# EAGLE schematic board (EAGLE 9.5.2)
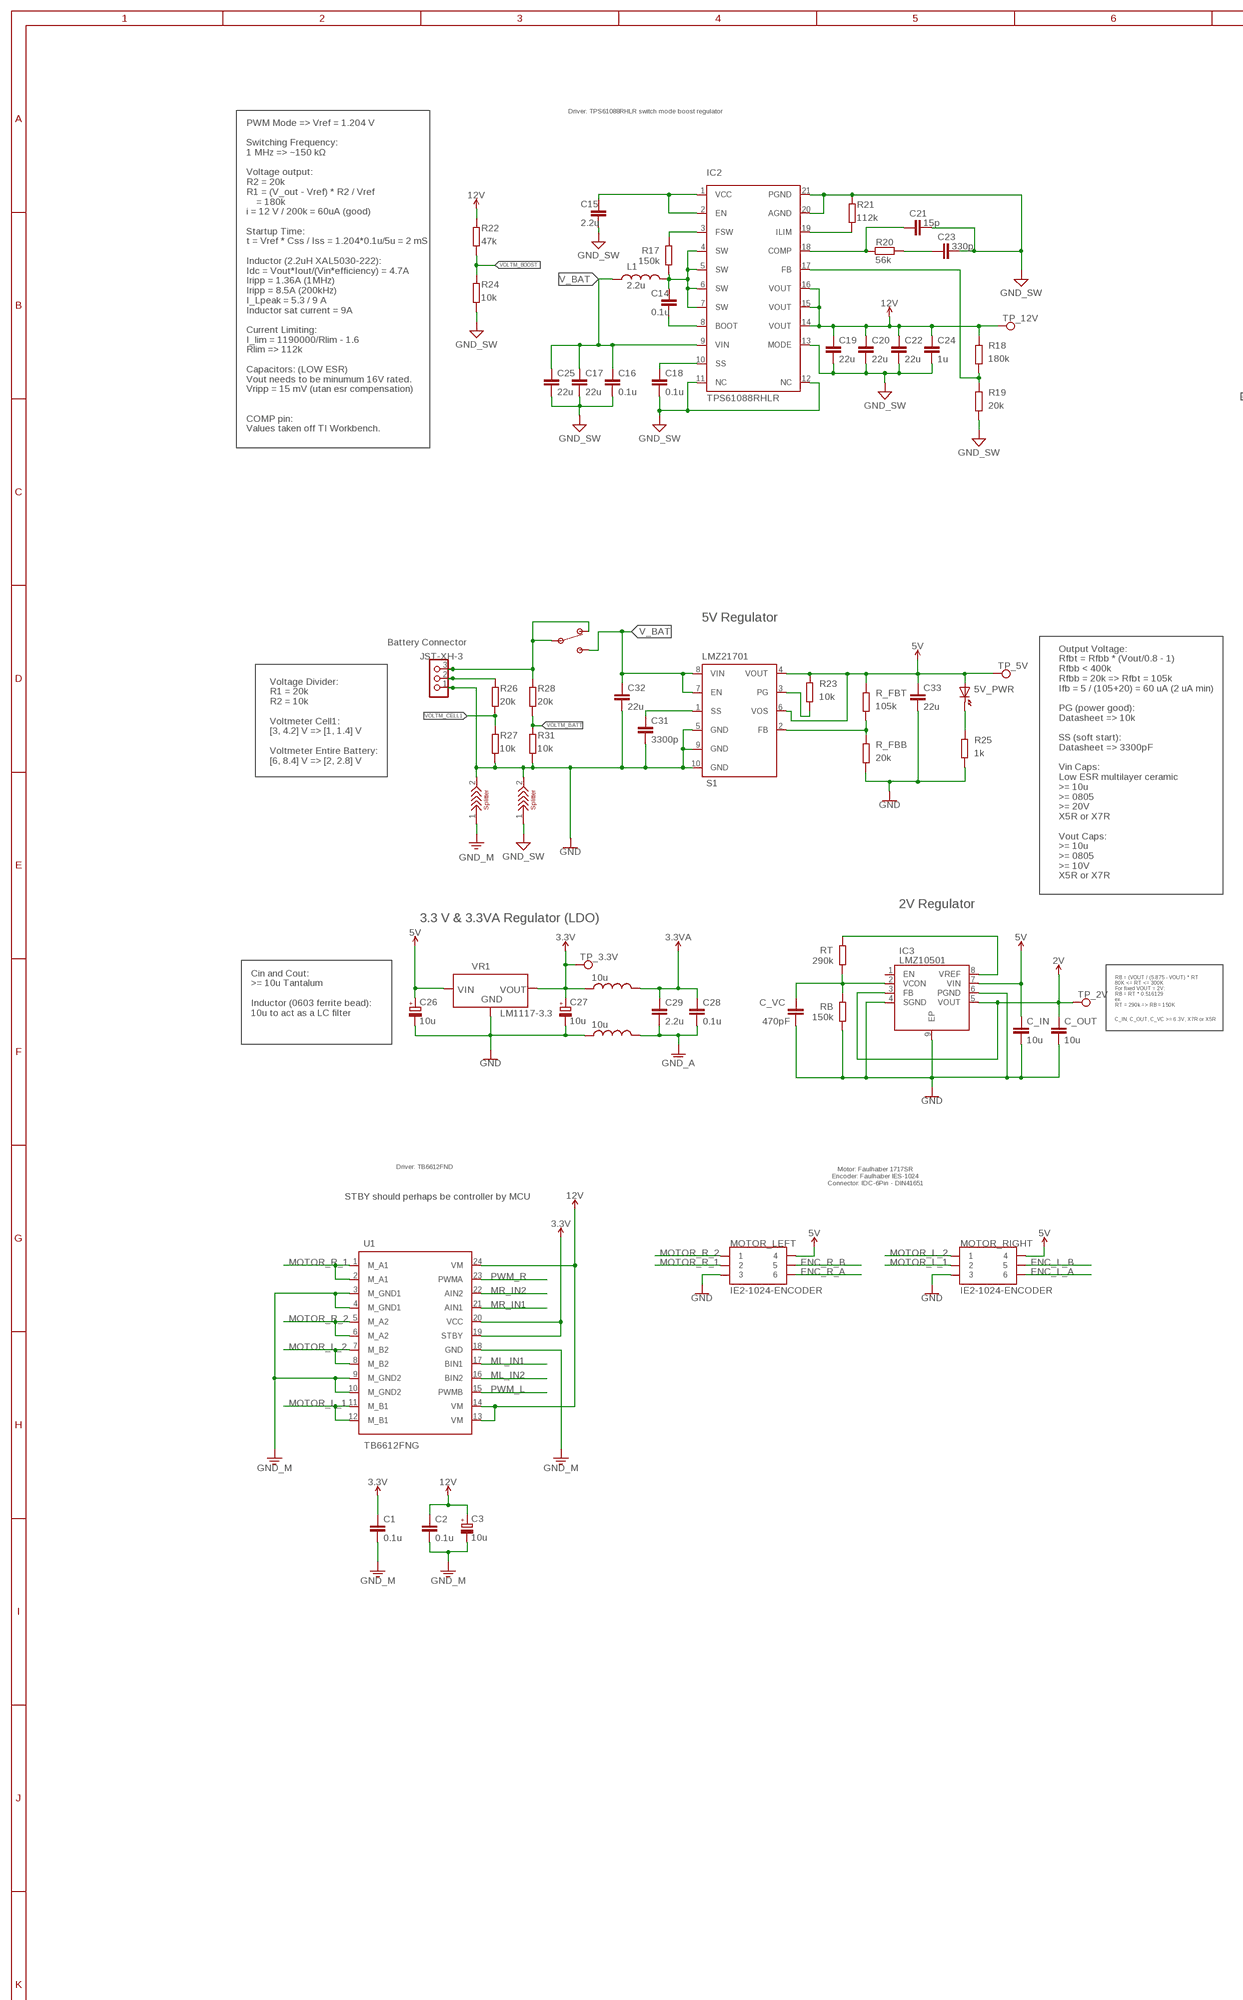
[diagram p0: schematic, sheet 1, part 1 of 3]
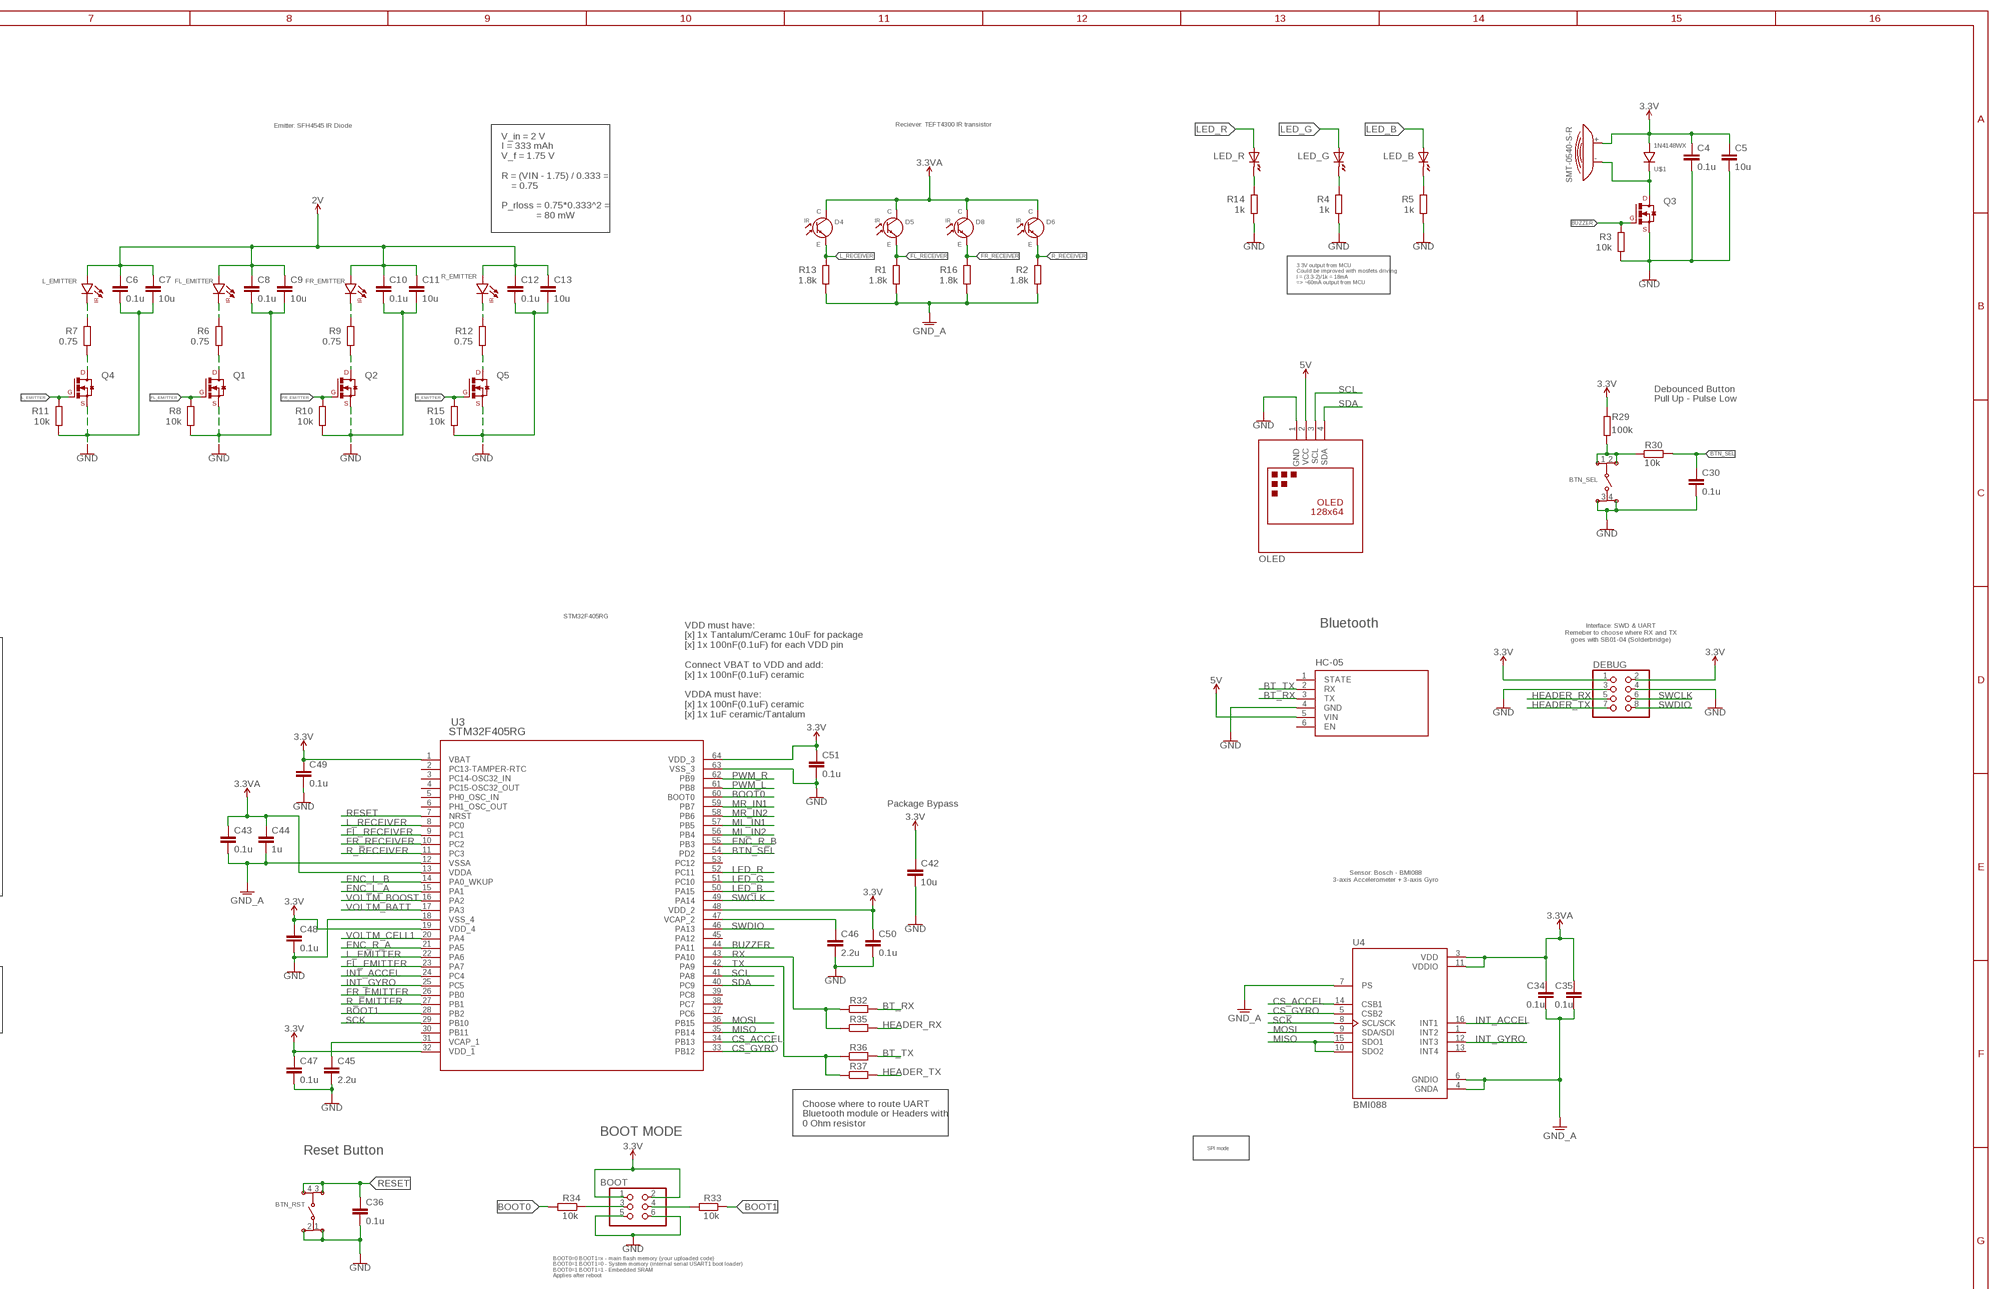
[diagram p1: schematic, sheet 1, part 2 of 3]
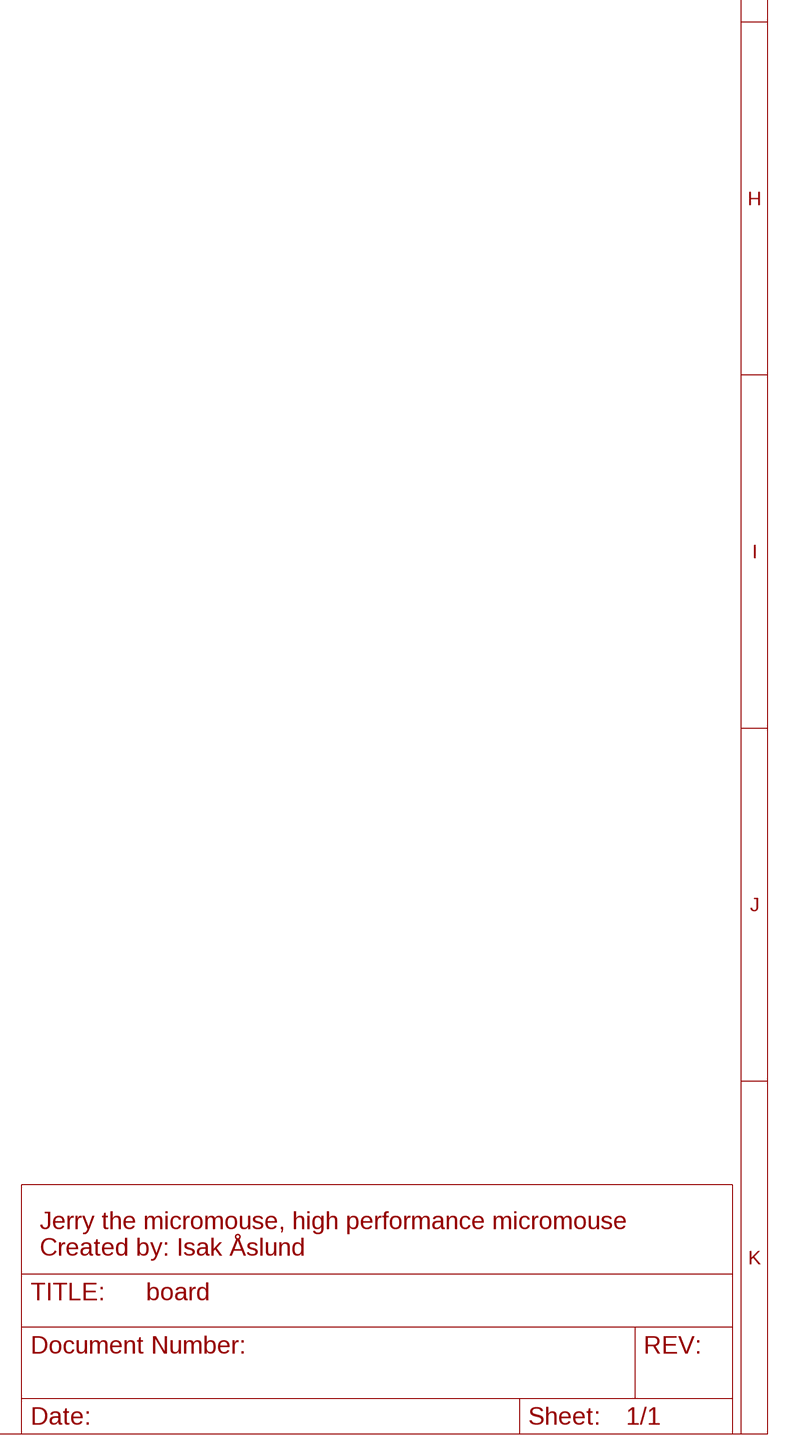
[diagram p2: schematic, sheet 1, part 3 of 3]

## Parts
5V_PWR  CHIP-LED0603  [CHIP-LED0603]
BOOT  PINHD-2X3  [2X03]
BTN_RST  KMR621NGLFS  [KMR621NGLFS]
BTN_SEL  KMR621NGLFS  [KMR621NGLFS]
C1  0.1u  C0603  [C0603]
C2  0.1u  C0603  [C0603]
C3  10u  KEMET_C  [EIA_6032-28]
C4  0.1u  C0603  [C0603]
C5  10u  C0603  [C0603]
C6  0.1u  C0603  [C0603]
C7  10u  C0603  [C0603]
C8  0.1u  C0603  [C0603]
C9  10u  C0603  [C0603]
C10  0.1u  C0603  [C0603]
C11  10u  C0603  [C0603]
C12  0.1u  C0603  [C0603]
C13  10u  C0603  [C0603]
C14  0.1u  C0603  [C0603]
C15  2.2u  C0603  [C0603]
C16  0.1u  C0805  [C0805]
C17  22u  C0805  [C0805]
C18  0.1u  C0603  [C0603]
C19  22u  C0805  [C0805]
C20  22u  C0805  [C0805]
C21  15p  C0603  [C0603]
C22  22u  C0805  [C0805]
C23  330p  C0603  [C0603]
C24  1u  C0805  [C0805]
C25  22u  C0805  [C0805]
C26  10u  SMC_A  [SMC_A]
C27  10u  SMC_A  [SMC_A]
C28  0.1u  C0603  [C0603]
C29  2.2u  C0603  [C0603]
C30  0.1u  C0603  [C0603]
C31  3300p  C0603  [C0603]
C32  22u  C0805  [C0805]
C33  22u  C0805  [C0805]
C34  0.1u  C0603  [C0603]
C35  0.1u  C0603  [C0603]
C36  0.1u  C0603  [C0603]
C42  10u  C0603  [C0603]
C43  0.1u  C0603  [C0603]
C44  1u  C0603  [C0603]
C45  2.2u  C0603  [C0603]
C46  2.2u  C0603  [C0603]
C47  0.1u  C0603  [C0603]
C48  0.1u  C0603  [C0603]
C49  0.1u  C0603  [C0603]
C50  0.1u  C0603  [C0603]
C51  0.1u  C0603  [C0603]
C_IN  10u  C0805  [C0805]
C_OUT  10u  C0805  [C0805]
C_VC  470pF  C0603  [C0603]
D4  TEFT4300  [3MM_PHOTOTRANSISTOR]
D5  TEFT4300  [3MM_PHOTOTRANSISTOR]
D6  TEFT4300  [3MM_PHOTOTRANSISTOR]
D8  TEFT4300  [3MM_PHOTOTRANSISTOR]
DEBUG  PINHD-2X4  [2X04]
FL_EMITTER  SFH_4545  [SFH_4545]
FP1  10u  WE-CBF_0805  [R0805]
FP2  10u  WE-CBF_0805  [R0805]
FR_EMITTER  SFH_4545  [SFH_4545]
HC-05  WIRELESS-BLUETOOTH-HC-05  [WIRELESS-BLUETOOTH-HC-05]
IC2  TPS61088RHLR  [RHL(R-PVQFN-N20)_1]
IC3  LMZ10501  [SON65P260X300X150-9N]
L1  2.2u  XAL5030-222MEC  [XAL5030]
L_EMITTER  SFH_4545  [SFH_4545]
LED_B  CHIP-LED0603  [CHIP-LED0603]
LED_G  CHIP-LED0603  [CHIP-LED0603]
LED_R  CHIP-LED0603  [CHIP-LED0603]
MOTOR_LEFT  IE2-1024-ENCODER  [IE2-1024-ENCODER]
MOTOR_RIGHT  IE2-1024-ENCODER  [IE2-1024-ENCODER]
OLED  DISPLAY-OLED-128X64-I2C  [DISPLAY-OLED-128X64-I2C]
Q1  IRFML8244TRPBF  [SOT95P235X110-3]
Q2  IRFML8244TRPBF  [SOT95P235X110-3]
Q3  IRFML8244TRPBF  [SOT95P235X110-3]
Q4  IRFML8244TRPBF  [SOT95P235X110-3]
Q5  IRFML8244TRPBF  [SOT95P235X110-3]
R1  1.8k  R0603  [R0603]
R2  1.8k  R0603  [R0603]
R3  10k  R0603  [R0603]
R4  1k  R0603  [R0603]
R5  1k  R0603  [R0603]
R6  0.75  R0603  [R0603]
R7  0.75  R0603  [R0603]
R8  10k  R0603  [R0603]
R9  0.75  R0603  [R0603]
R10  10k  R0603  [R0603]
R11  10k  R0603  [R0603]
R12  0.75  R0603  [R0603]
R13  1.8k  R0603  [R0603]
R14  1k  R0603  [R0603]
R15  10k  R0603  [R0603]
R16  1.8k  R0603  [R0603]
R17  150k  R0603  [R0603]
R18  180k  R0603  [R0603]
R19  20k  R0603  [R0603]
R20  56k  R0603  [R0603]
R21  112k  R0603  [R0603]
R22  47k  R0603  [R0603]
R23  10k  R0603  [R0603]
R24  10k  R0603  [R0603]
R25  1k  R0603  [R0603]
R26  20k  R0603  [R0603]
R27  10k  R0603  [R0603]
R28  20k  R0603  [R0603]
R29  100k  R0603  [R0603]
R30  10k  R0603  [R0603]
R31  10k  R0603  [R0603]
R32  0  R0603  [R0603]
R33  10k  R0603  [R0603]
R34  10k  R0603  [R0603]
R35  0  R0603  [R0603]
R36  0  R0603  [R0603]
R37  0  R0603  [R0603]
R_EMITTER  SFH_4545  [SFH_4545]
R_FBB  20k  R0603  [R0603]
R_FBT  105k  R0603  [R0603]
RB  150k  R0603  [R0603]
RT  290k  R0603  [R0603]
S1  LMZ21701  [LMZ21701]
SW  SPDT-500SSP1S1M6QEA  [500SSP1S1M6QEA]
TP_2V  TEST-POINT3X5  [PAD.03X.05]
TP_3.3V  TEST-POINT3X5  [PAD.03X.05]
TP_5V  TEST-POINT3X5  [PAD.03X.05]
TP_12V  TEST-POINT3X5  [PAD.03X.05]
U1  TB6612FNG  [SOP65P760X160-24]
U3  STM32F405RG  [LQFP-64]
U4  BMI088  [PQFN50P450X300X100-16N]
U$1  1N4148WX  DIODE_1N4148WX  [1N4148WX_SOD-323-2]
U$4  SMT-0540-S-R  [SMT-0540-S-R]
U$6  SPLITTER  [SPLITTER]
U$7  SPLITTER  [SPLITTER]
U$10  JST-XH-3  [JST-XH-03]
VR1  LM1117-3.3  [SOT230P700X180-4]

## Nets
2V: C6.1 C7.1 C8.1 C9.1 C10.1 C11.1 C12.1 C13.1 C_OUT.1 FL_EMITTER.+(+_ANODE) FR_EMITTER.+(+_ANODE) IC3.3(FB) IC3.5(VOUT) L_EMITTER.+(+_ANODE) R_EMITTER.+(+_ANODE) TP_2V.P$1
3.3V: BOOT.1 BOOT.2 C1.1 C4.1 C5.1 C27.+ C42.1 C47.1 C48.1 C49.1 C50.1 C51.1 DEBUG.1 DEBUG.2 FP1.1 R29.1 TP_3.3V.P$1 U1.19(STBY) U1.20(VCC) U3.1(VBAT) U3.19(VDD_4) U3.32(VDD_1) U3.48(VDD_2) U3.64(VDD_3) U$1.+(+_ANODE) U$4.+ VR1.2(VOUT) VR1.4(VOUT)
3.3VA: C28.1 C29.1 C34.1 C35.1 C43.1 C44.1 D4.C(C_+) D5.C(C_+) D6.C(C_+) D8.C(C_+) FP1.2 U3.13(VDDA) U4.3(VDD) U4.11(VDDIO)
5V: 5V_PWR.A C26.+ C33.1 C_IN.1 HC-05.5(VIN) IC3.7(VIN) MOTOR_LEFT.4 MOTOR_RIGHT.4 OLED.2(VCC) R23.2 R_FBT.1 S1.4(VOUT) S1.6(VOS) TP_5V.P$1 VR1.3(VIN)
12V: C2.1 C3.1(+) C19.1 C20.1 C22.1 C24.1 IC2.14(VOUT) IC2.15(VOUT) IC2.16(VOUT) R18.1 R22.2 TP_12V.P$1 U1.13(VM) U1.14(VM) U1.24(VM)
BOOT0: R34.2 U3.60(BOOT0)
BOOT1: R33.1 U3.28(PB2)
BT_RX: HC-05.3(TX) R32.2
BT_TX: HC-05.2(RX) R36.2
BTN_SEL: C30.1 R30.2 U3.54(PD2)
BUZZER: Q3.1(G) R3.2 U3.44(PA11)
CS_ACCEL: U3.34(PB13) U4.14(CSB1)
CS_GYRO: U3.33(PB12) U4.5(CSB2)
ENC_L_A: MOTOR_RIGHT.6 U3.15(PA1)
ENC_L_B: MOTOR_RIGHT.5 U3.14(PA0_WKUP)
ENC_R_A: MOTOR_LEFT.6 U3.21(PA5)
ENC_R_B: MOTOR_LEFT.5 U3.55(PB3)
FL_EMITTER: Q1.1(G) R8.2 U3.23(PA7)
FL_RECEIVER: D5.E(E_-) R1.2 U3.9(PC1)
FR_EMITTER: Q2.1(G) R10.2 U3.26(PB0)
FR_RECEIVER: D8.E(E_-) R16.2 U3.10(PC2)
GND: BOOT.5 BOOT.6 BTN_RST.1 BTN_RST.2 BTN_SEL.3 BTN_SEL.4 C4.2 C5.2 C6.2 C7.2 C8.2 C9.2 C10.2 C11.2 C12.2 C13.2 C26.- C27.- C30.2 C31.2 C32.2 C33.2 C36.2 C42.2 C45.2 C46.2 C47.2 C48.2 C49.2 C50.2 C51.2 C_IN.2 C_OUT.2 C_VC.2 DEBUG.3 DEBUG.4 FP2.1 HC-05.4(GND) IC3.4(SGND) IC3.6(PGND) IC3.9(EP) MOTOR_LEFT.3 MOTOR_RIGHT.3 OLED.1(GND) Q1.2(S) Q2.2(S) Q3.2(S) Q4.2(S) Q5.2(S) R3.1 R4.1 R5.1 R8.1 R10.1 R11.1 R14.1 R15.1 R25.1 R27.1 R31.1 R_FBB.1 RB.1 S1.5(GND) S1.9(GND) S1.10(GND) U3.18(VSS_4) U3.63(VSS_3) U$6.2 U$7.2 U$10.1 VR1.1(GND)
GND_A: C28.2 C29.2 C34.2 C35.2 C43.2 C44.2 FP2.2 R1.1 R2.1 R13.1 R16.1 U3.12(VSSA) U4.4(GNDA) U4.6(GNDIO) U4.7(PS)
GND_M: C1.2 C2.2 C3.2(-) U1.3(M_GND1) U1.4(M_GND1) U1.9(M_GND2) U1.10(M_GND2) U1.18(GND) U$6.1
GND_SW: C15.2 C16.2 C17.2 C18.2 C19.2 C20.2 C21.2 C22.2 C23.2 C24.2 C25.2 IC2.11(NC) IC2.12(NC) IC2.13(MODE) IC2.20(AGND) IC2.21(PGND) R19.2 R21.2 R24.1 U$7.1
HEADER_RX: DEBUG.5 R35.2
HEADER_TX: DEBUG.7 R37.2
INT_ACCEL: U3.24(PC4) U4.16(INT1)
INT_GYRO: U3.25(PC5) U4.12(INT3)
L_EMITTER: Q4.1(G) R11.2 U3.22(PA6)
L_RECEIVER: D4.E(E_-) R13.2 U3.8(PC0)
LED_B: LED_B.A U3.50(PA15)
LED_G: LED_G.A U3.51(PC10)
LED_R: LED_R.A U3.52(PC11)
MISO: U3.35(PB14) U4.10(SDO2) U4.15(SDO1)
ML_IN1: U1.17(BIN1) U3.57(PB5)
ML_IN2: U1.16(BIN2) U3.56(PB4)
MOSI: U3.36(PB15) U4.9(SDA/SDI)
MOTOR_L_1: MOTOR_RIGHT.2 U1.11(M_B1) U1.12(M_B1)
MOTOR_L_2: MOTOR_RIGHT.1 U1.7(M_B2) U1.8(M_B2)
MOTOR_R_1: MOTOR_LEFT.2 U1.1(M_A1) U1.2(M_A1)
MOTOR_R_2: MOTOR_LEFT.1 U1.5(M_A2) U1.6(M_A2)
MR_IN1: U1.21(AIN1) U3.59(PB7)
MR_IN2: U1.22(AIN2) U3.58(PB6)
N$1: Q4.3(D) R7.1
N$2: L_EMITTER.-(-_CATHODE) R7.2
N$3: LED_R.C(K) R14.2
N$4: Q1.3(D) R6.1
N$5: FL_EMITTER.-(-_CATHODE) R6.2
N$6: LED_G.C(K) R4.2
N$7: Q5.3(D) R12.1
N$8: Q2.3(D) R9.1
N$9: LED_B.C(K) R5.2
N$10: IC3.8(VREF) RT.2
N$11: C_VC.1 IC3.2(VCON) RB.2 RT.1
N$12: R12.2 R_EMITTER.-(-_CATHODE)
N$13: Q3.3(D) U$1.-(-_CATHODE) U$4.-
N$14: FR_EMITTER.-(-_CATHODE) R9.2
N$15: C14.1 IC2.4(SW) IC2.5(SW) IC2.6(SW) IC2.7(SW) L1.2 R17.1
N$16: IC2.3(FSW) R17.2
N$17: C14.2 IC2.8(BOOT)
N$18: C15.1 IC2.1(VCC) IC2.2(EN)
N$19: C18.1 IC2.10(SS)
N$20: IC2.17(FB) R18.2 R19.1
N$21: C21.1 IC2.18(COMP) R20.1
N$22: IC2.19(ILIM) R21.1
N$23: C23.1 R20.2
N$24: C31.1 S1.1(SS)
N$25: R_FBB.2 R_FBT.2 S1.2(FB)
N$27: R23.1 S1.3(PG)
N$31: 5V_PWR.C(K) R25.2
N$32: BOOT.4 R33.2
N$33: R26.2 U$10.2
N$34: BOOT.3 R34.1
N$35: BTN_SEL.1 BTN_SEL.2 R29.2 R30.1
N$36: C45.1 U3.31(VCAP_1)
N$37: C46.1 U3.47(VCAP_2)
N$38: R28.2 SW.1 SW.2_COM(COM) U$10.3
PWM_L: U1.15(PWMB) U3.61(PB8)
PWM_R: U1.23(PWMA) U3.62(PB9)
R_EMITTER: Q5.1(G) R15.2 U3.27(PB1)
R_RECEIVER: D6.E(E_-) R2.2 U3.11(PC3)
RESET: BTN_RST.3 BTN_RST.4 C36.1 U3.7(NRST)
RX: R32.1 R35.1 U3.43(PA10)
SCK: U3.29(PB10) U4.8(SCL/SCK)
SCL: OLED.3(SCL) U3.41(PA8)
SDA: OLED.4(SDA) U3.40(PC9)
SWCLK: DEBUG.6 U3.49(PA14)
SWDIO: DEBUG.8 U3.46(PA13)
TX: R36.1 R37.1 U3.42(PA9)
V_BAT: C16.1 C17.1 C25.1 C32.1 IC2.9(VIN) L1.1 S1.7(EN) S1.8(VIN) SW.3
VOLTM_BATT: R28.1 R31.2 U3.17(PA3)
VOLTM_BOOST: R22.1 R24.2 U3.16(PA2)
VOLTM_CELL1: R26.1 R27.2 U3.20(PA4)
Unconnected: HC-05.1(STATE) HC-05.6(EN) IC3.1(EN) U3.2(PC13-TAMPER-RTC) U3.3(PC14-OSC32_IN) U3.4(PC15-OSC32_OUT) U3.5(PH0_OSC_IN) U3.6(PH1_OSC_OUT) U3.30(PB11) U3.37(PC6) U3.38(PC7) U3.39(PC8) U3.45(PA12) U3.53(PC12) U4.1(INT2) U4.13(INT4)

## Notes on the sheet
- Driver: TPS61088RHLR switch mode boost regulator
- PWM Mode => Vref = 1.204 V
  
  Switching Frequency:
  1 MHz => ~150 kΩ
  
  Voltage output:
  R2 = 20k
  R1 = (V_out - Vref) * R2 / Vref
      = 180k
  i = 12 V / 200k = 60uA (good)
  
  Startup Time:
  t = Vref * Css / Iss = 1.204*0.1u/5u = 2 mS
  
  Inductor (2.2uH XAL5030-222):
  Idc = Vout*Iout/(Vin*efficiency) = 4.7A
  Iripp = 1.36A (1MHz)
  Iripp = 8.5A (200kHz)
  I_Lpeak = 5.3 / 9 A
  Inductor sat current = 9A
  
  Current Limiting:
  I_lim = 1190000/Rlim - 1.6
  Rlim => 112k
  
  Capacitors: (LOW ESR)
  Vout needs to be minumum 16V rated.
  Vripp = 15 mV (utan esr compensation)
  
  
  COMP pin:
  Values taken off TI Workbench.
- Reciever: TEFT4300 IR transistor
- Emitter: SFH4545 IR Diode
- V_in = 2 V
  I = 333 mAh
  V_f = 1.75 V
  
  R = (VIN - 1.75) / 0.333 =
      = 0.75
  
  P_rloss = 0.75*0.333^2 =
                = 80 mW
- 3.3V output from MCU
  Could be improved with mosfets driving
  I = (3.3-2)/1k = 18mA 
  => ~60mA output from MCU
- Debounced Button
  Pull Up - Pulse Low
- STM32F405RG
- 5V Regulator
- Bluetooth
- Interface: SWD & UART
  Remeber to choose where RX and TX
  goes with SB01-04 (Solderbridge)
- Battery Connector
- Output Voltage:
  Rfbt = Rfbb * (Vout/0.8 - 1)
  Rfbb < 400k
  Rfbb = 20k => Rfbt = 105k
  Ifb = 5 / (105+20) = 60 uA (2 uA min)
  
  PG (power good):
  Datasheet => 10k
  
  SS (soft start):
  Datasheet => 3300pF
  
  Vin Caps:
  Low ESR multilayer ceramic
  >= 10u
  >= 0805
  >= 20V
  X5R or X7R
  
  Vout Caps:
  >= 10u
  >= 0805
  >= 10V
  X5R or X7R
- Voltage Divider:
  R1 = 20k
  R2 = 10k
  
  Voltmeter Cell1:
  [3, 4.2] V => [1, 1.4] V
  
  Voltmeter Entire Battery:
  [6, 8.4] V => [2, 2.8] V
- VDD must have:
  [x] 1x Tantalum/Ceramc 10uF for package
  [x] 1x 100nF(0.1uF) for each VDD pin
  
  Connect VBAT to VDD and add:
  [x] 1x 100nF(0.1uF) ceramic
  
  VDDA must have:
  [x] 1x 100nF(0.1uF) ceramic
  [x] 1x 1uF ceramic/Tantalum
- Package Bypass
- Sensor: Bosch - BMI088
  3-axis Accelerometer + 3-axis Gyro
- 2V Regulator
- 3.3 V & 3.3VA Regulator (LDO)
- RB = (VOUT / (5.875 - VOUT) * RT
  80K <= RT <= 300K
  For fixed VOUT = 2V:
  RB = RT * 0.516129
  ex.
  RT = 290k => RB = 150K
- C_IN, C_OUT, C_VC >= 6.3V, X7R or X5R
- Cin and Cout:
  >= 10u Tantalum
  
  Inductor (0603 ferrite bead):
  10u to act as a LC filter
- Choose where to route UART 
  Bluetooth module or Headers with
  0 Ohm resistor
- BOOT MODE
- SPI mode
- Reset Button
- Driver: TB6612FND
- Motor: Faulhaber 1717SR
  Encoder: Faulhaber IES-1024
  Connector: IDC-6Pin - DIN41651
- STBY should perhaps be controller by MCU
- BOOT0=0 BOOT1=x - main flash memory (your uploaded code)
  BOOT0=1 BOOT1=0 - System momory (internal serial USART1 boot loader) 
  BOOT0=1 BOOT1=1 - Embedded SRAM
  Applies after reboot
- Jerry the micromouse, high performance micromouse
  Created by: Isak Åslund

## Library data of the parts
5V_PWR LED_B LED_G LED_R = CASE-LED:CHIP-LED0603: CHIP-LED0603 (SMD) Description: Standard 0603 SMD CHIP-LED
BOOT = CASE-Pinhead:PINHD-2X3: PIN HEADER
BTN_RST BTN_SEL = CASE-Switches:KMR621NGLFS: C&K KMR621NG LFS Tactile SPST switch (SMD) Description: C&K KMR621NG LFS Tactile SPST switch SMD package. Links: KMR621NG LFS <http://www.farnell.com/datasheets/2706242.pdf?_ga=2.40597409.2071720333.1546461288-1112771566.1525371275>
C1 C2 C4-C15 C18 C21 C23 C28-C30 C34-C36 C42-C51 = CASE-RCL:C0603: Standard Chip CAPACITOR 0605 (1608 Metric) Description: Standard Chip CAPACITOR 0605 (1608 Metric)
C3 = CASE-RCL:KEMET_C: KEMET C Size Taltalum Capacitator Description: Size C taltalum capacitor from KEMET. (EIA size 6032-28) Links: Datasheet <http://www.farnell.com/datasheets/2206954.pdf?_ga=2.146371188.1951585514.1537363662-1535130828.1530438260>
C16 C17 C19 C20 C22 C24 C25 C_IN C_OUT = CASE-RCL:C0805: Standard Chip CAPACITOR 0805 (2012 Metric) Description: Standard Chip CAPACITOR 0805 (2012 Metric)
C26 C27 = Isaks Bibliotek:SMC_A: A Size Taltalum Capacitator Description: Size A taltalum capacitor (EIA size 3216-18)
C31 = CASE-RCL:C0603: Standard Chip CAPACITOR 0605 (1608 Metric) Description: Standard Chip CAPACITOR 0605 (1608 Metric); RATING: X5R/X7R; V_RATING: 10V
C32 = CASE-RCL:C0805: Standard Chip CAPACITOR 0805 (2012 Metric) Description: Standard Chip CAPACITOR 0805 (2012 Metric); RATING: X5R/X7R; V_RATING: 25V
C33 = CASE-RCL:C0805: Standard Chip CAPACITOR 0805 (2012 Metric) Description: Standard Chip CAPACITOR 0805 (2012 Metric); V_RATING: 10v
C_VC = CASE-RCL:C0603: Standard Chip CAPACITOR 0605 (1608 Metric) Description: Standard Chip CAPACITOR 0605 (1608 Metric); RATING: X5R/X7R; V_RATING: 6.3V
D4-D6 D8 = Isaks Bibliotek:TEFT4300: TEFT4300 Phototransistor from Vishay
DEBUG = CASE-Pinhead:PINHD-2X4: PIN HEADER
FL_EMITTER FR_EMITTER L_EMITTER R_EMITTER = Isaks Bibliotek:SFH_4545: High Power Infrared Emitter (940 nm)
FP1 FP2 = CASE-RCL:WE-CBF_0805: Würth Electronics Size 0805 Ferrite Pearls Description: 0805 Size ferrite pearls from Würth Electronics. Links: Datasheet <http://www.farnell.com/datasheets/1269564.pdf?_ga=2.183721318.1951585514.1537363662-1535130828.1530438260>
HC-05 = Isaks Bibliotek:WIRELESS-BLUETOOTH-HC-05: Bluetooth Transceiver Module based on HC-05 board Tutorial is available here: https://arduino-info.wikispaces.com/BlueTooth-HC05-HC06-Modules-How-To Click here to find device on ebay.com <http://www.ebay.com/sch/hc-05+module+rs232>
IC2 = Isaks Bibliotek:TPS61088RHLR: DC-DC Boost Regulator Description: Input: 2.7 - 12 V Output:4.5 - 12.6V I_out = 3A Source: Datasheet <http://www.ti.com/lit/gpn/tps61088>; DESCRIPTION: 10-A Fully-Integrated Synchronous Boost Converter; HEIGHT: mm; MANUFACTURER_NAME: Texas Instruments; MANUFACTURER_PART_NUMBER: TPS61088RHLR; MOUSER_PART_NUMBER: 595-TPS61088RHLR; MOUSER_PRICE-STOCK: https://www.mouser.com/Search/Refine.aspx?Keyword=595-TPS61088RHLR
IC3 = Isaks Bibliotek:LMZ10501: Voltage Regulators - Switching Regulators 1A Nano Mod w/ 5.5V Max Inpt VTG Source: Datasheet <http://www.ti.com/lit/ds/symlink/lmz10501.pdf>; DESCRIPTION: Voltage Regulators - Switching Regulators 1A Nano Mod w/ 5.5V Max Inpt VTG; HEIGHT: 1.5mm; MANUFACTURER_NAME: Texas Instruments; MANUFACTURER_PART_NUMBER: LMZ10501SILT; MOUSER_PART_NUMBER: 595-LMZ10501SILT; MOUSER_PRICE-STOCK: https://www.mouser.com/Search/Refine.aspx?Keyword=595-LMZ10501SILT
L1 = Isaks Bibliotek:XAL5030-222MEC: COILCRAFT - XAL5030-222MEC - INDUCTOR, PWR, 2.2UH, 9.2A,20%,38MHZ Source: Datasheet <https://componentsearchengine.com/Datasheets/1/XAL5030-222MEC.pdf>; DESCRIPTION: COILCRAFT - XAL5030-222MEC - INDUCTOR, PWR, 2.2UH, 9.2A,20%,38MHZ; HEIGHT: mm; MANUFACTURER_NAME: COILCRAFT; MANUFACTURER_PART_NUMBER: XAL5030-222MEC; MOUSER_PART_NUMBER: 994-XAL5030-222MEC; MOUSER_PRICE-STOCK: https://www.mouser.com/Search/Refine.aspx?Keyword=994-XAL5030-222MEC
MOTOR_LEFT MOTOR_RIGHT = Isaks Bibliotek:IE2-1024-ENCODER
OLED = Isaks Bibliotek:DISPLAY-OLED-128X64-I2C: 128x64 Dot Matrix OLED Module based on SSD1306 chip Variant with I2C interface More details available here: http://www.instructables.com/id/Monochrome-096-i2c-OLED-display-with-arduino-SSD13/ SSD1306 datasheet: https://cdn-shop.adafruit.com/datasheets/SSD1306.pdf Click here to find device on ebay.com <http://www.ebay.com/sch/oled+display+128x64+iic> Note: There are two variants: I2C and SPI. Search for the proper version.
Q1-Q5 = Isaks Bibliotek:IRFML8244TRPBF: IRFML8244TRPbF - N Channel Mosfet Link: Datasheet <https://www.infineon.com/dgdl/irfml8244pbf.pdf?fileId=5546d462533600a40153562817c91fc0>
R1-R22 R24-R37 R_FBB R_FBT RB = CASE-RCL:R0603: Standard Chip RESISTOR 0603 (1608 Metric) Description: Standard Chip RESISTOR 0603 (1608 Metric)
R23 RT = CASE-RCL:R0603: Standard Chip RESISTOR 0603 (1608 Metric) Description: Standard Chip RESISTOR 0603 (1608 Metric); TOLERANCE: 1%
S1 = Isaks Bibliotek:LMZ21701: 3V to 17V, 1A Step-Down DC/DC Power Module in 3.5mm 3.5mm Package Source: Datasheet <http://www.mouser.com/ds/2/405/lmz21701-469837.pdf>; DESCRIPTION: 3V to 17V, 1A Step-Down DC/DC Power Module in 3.5mm 3.5mm Package; HEIGHT: mm; MANUFACTURER_NAME: Texas Instruments; MANUFACTURER_PART_NUMBER: LMZ21701SILR; MOUSER_PART_NUMBER: 595-LMZ21701SILR; MOUSER_PRICE-STOCK: https://www.mouser.com/Search/Refine.aspx?Keyword=595-LMZ21701SILR
SW = Isaks Bibliotek:SPDT-500SSP1S1M6QEA
TP_2V TP_3.3V TP_5V TP_12V = Isaks Bibliotek:TEST-POINT: Test Points Bare copper test points for troubleshooting or In-Circuit-Testing.
U1 = Isaks Bibliotek:TB6612FNG: TB6612FNG - Dual DC motor driver Link: Datasheet <https://www.sparkfun.com/datasheets/Robotics/TB6612FNG.pdf>; I_BURST: 3.2 A; I_CONT: 1.2 A; V_MAX: 15 V
U3 = Isaks Bibliotek:STM32F405RG: STM32F405RG Microcontroller Description: Arm Cortex M4 processor, ~160MHz Link: DataSheet <https://www.st.com/resource/en/datasheet/stm32f405rg.pdf>
U4 = Isaks Bibliotek:BMI088: High-performance 6-axis inertial sensor (accelerometer + gyroscope); AVAILABILITY: Unavailable; DESCRIPTION: High-performance 6-axis inertial sensor _accelerometer + gyroscope_; MF: Bosch Sensortec; MP: BMI088; PACKAGE: VFLGA-16 Bosch Sensortec; PRICE: None
U$1 = Isaks Bibliotek:DIODE_1N4148WX
U$4 = Isaks Bibliotek:SMT-0540-S-R: Magnetic buzzer Description: SMD Link: Datasheet <http://www.puiaudio.com/pdf/SMT-0540-S-R.pdf>
U$6 U$7 = Isaks Bibliotek:SPLITTER: Used for separating grounds
U$10 = Isaks Bibliotek:JST-XH-3
VR1 = Isaks Bibliotek:LM1117-3.3: LM1117 Description: Fixed output voltage regulator Out: 3.3V, 800mA Link: Datasheet <https://datasheet.lcsc.com/szlcsc/Texas-Instruments-TI-LM1117IMPX-3-3-NOPB_C23984.pdf> LCSC.nr: C23984; IMAX: 800mA; VIN_MAX: 20; VOUT: 3.3V